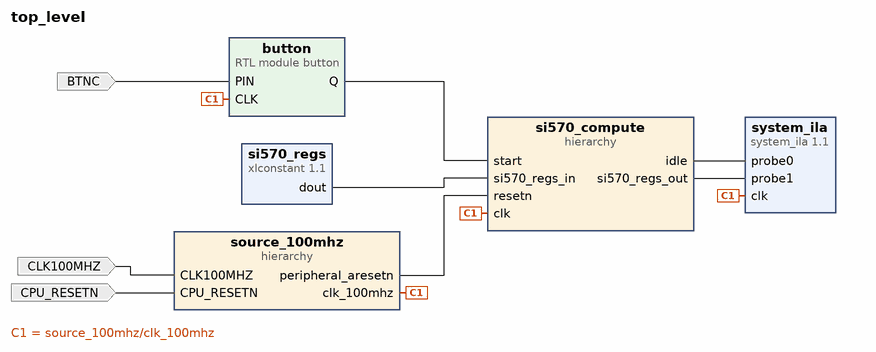
[diagram p0: block diagram of the top level]
# Vivado block design top_level, xc7a100tcsg324-1, Vivado 2021.1
create_bd_design top_level

create_bd_port -dir I -type clk CLK100MHZ
set_property -dict {CONFIG.ASSOCIATED_RESET CPU_RESETN} [get_bd_ports CLK100MHZ]
create_bd_port -dir I -type rst CPU_RESETN
create_bd_port -dir I BTNC

create_bd_cell -type hier source_100mhz
create_bd_cell -type module -reference button button
create_bd_cell -type ip -vlnv xilinx.com:ip:xlconstant:1.1 si570_regs
set_property -dict {CONFIG.CONST_VAL 0x01C2BC011EB8 CONFIG.CONST_WIDTH 48} [get_bd_cells si570_regs]
create_bd_cell -type hier si570_compute
create_bd_cell -type ip -vlnv xilinx.com:ip:system_ila:1.1 system_ila
set_property -dict {CONFIG.C_MON_TYPE NATIVE CONFIG.C_NUM_OF_PROBES 2} [get_bd_cells system_ila]

# ---- hierarchy /source_100mhz ----
current_bd_instance /source_100mhz
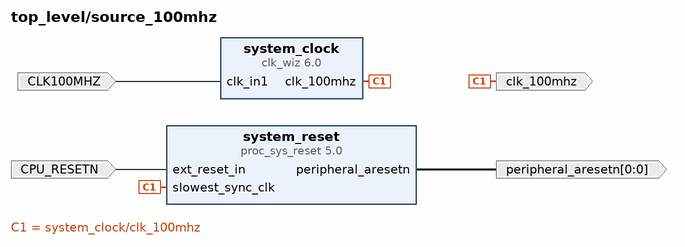
[diagram p1: block diagram inside /source_100mhz]
create_bd_pin -dir I -type clk CLK100MHZ
create_bd_pin -dir O -type clk clk_100mhz
create_bd_pin -dir I -type rst CPU_RESETN
create_bd_pin -dir O -from 0 -to 0 -type rst peripheral_aresetn

create_bd_cell -type ip -vlnv xilinx.com:ip:clk_wiz:6.0 system_clock
set_property -dict [list \
  CONFIG.CLKOUT1_DRIVES BUFGCE \
  CONFIG.CLKOUT2_DRIVES BUFGCE \
  CONFIG.CLKOUT3_DRIVES BUFGCE \
  CONFIG.CLKOUT4_DRIVES BUFGCE \
  CONFIG.CLKOUT5_DRIVES BUFGCE \
  CONFIG.CLKOUT6_DRIVES BUFGCE \
  CONFIG.CLKOUT7_DRIVES BUFGCE \
  CONFIG.CLK_OUT1_PORT clk_100mhz \
  CONFIG.FEEDBACK_SOURCE FDBK_AUTO \
  CONFIG.USE_LOCKED false \
  CONFIG.USE_RESET false \
  CONFIG.USE_SAFE_CLOCK_STARTUP true \
] [get_bd_cells system_clock]
create_bd_cell -type ip -vlnv xilinx.com:ip:proc_sys_reset:5.0 system_reset

# ---- hierarchy /si570_compute ----
current_bd_instance /si570_compute
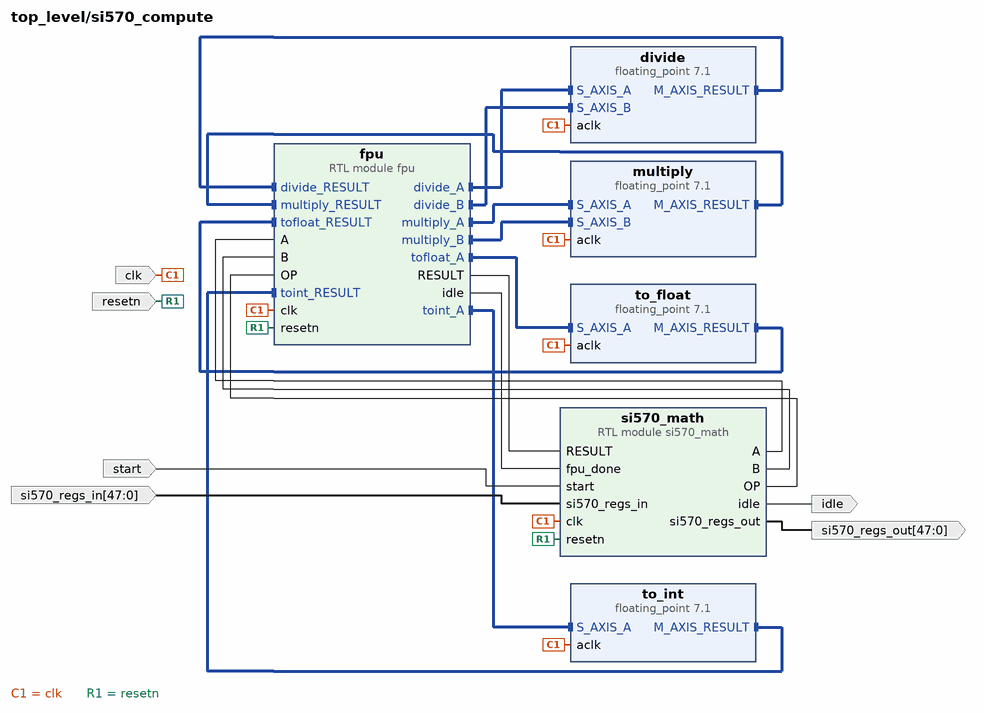
[diagram p2: block diagram inside /si570_compute]
create_bd_pin -dir I -type clk clk
create_bd_pin -dir I -type rst resetn
create_bd_pin -dir I start
create_bd_pin -dir I -from 47 -to 0 si570_regs_in
create_bd_pin -dir O idle
create_bd_pin -dir O -from 47 -to 0 si570_regs_out

create_bd_cell -type ip -vlnv xilinx.com:ip:floating_point:7.1 to_int
set_property -dict [list \
  CONFIG.A_Precision_Type Double \
  CONFIG.C_Accum_Input_Msb 32 \
  CONFIG.C_Accum_Lsb -31 \
  CONFIG.C_Accum_Msb 32 \
  CONFIG.C_Latency 7 \
  CONFIG.C_Mult_Usage No_Usage \
  CONFIG.C_Rate 1 \
  CONFIG.C_Result_Exponent_Width 64 \
  CONFIG.C_Result_Fraction_Width 0 \
  CONFIG.Operation_Type Float_to_fixed \
  CONFIG.Result_Precision_Type Custom \
] [get_bd_cells to_int]
create_bd_cell -type ip -vlnv xilinx.com:ip:floating_point:7.1 to_float
set_property -dict [list \
  CONFIG.A_Precision_Type Uint64 \
  CONFIG.C_A_Exponent_Width 64 \
  CONFIG.C_A_Fraction_Width 0 \
  CONFIG.C_Accum_Input_Msb 32 \
  CONFIG.C_Accum_Lsb -31 \
  CONFIG.C_Accum_Msb 32 \
  CONFIG.C_Latency 7 \
  CONFIG.C_Mult_Usage No_Usage \
  CONFIG.C_Rate 1 \
  CONFIG.C_Result_Exponent_Width 11 \
  CONFIG.C_Result_Fraction_Width 53 \
  CONFIG.Operation_Type Fixed_to_float \
  CONFIG.Result_Precision_Type Double \
] [get_bd_cells to_float]
create_bd_cell -type ip -vlnv xilinx.com:ip:floating_point:7.1 multiply
set_property -dict [list \
  CONFIG.A_Precision_Type Double \
  CONFIG.C_Accum_Input_Msb 32 \
  CONFIG.C_Accum_Lsb -31 \
  CONFIG.C_Accum_Msb 32 \
  CONFIG.C_Latency 16 \
  CONFIG.C_Mult_Usage Full_Usage \
  CONFIG.C_Rate 1 \
  CONFIG.C_Result_Exponent_Width 11 \
  CONFIG.C_Result_Fraction_Width 53 \
  CONFIG.Operation_Type Multiply \
  CONFIG.Result_Precision_Type Double \
] [get_bd_cells multiply]
create_bd_cell -type ip -vlnv xilinx.com:ip:floating_point:7.1 divide
set_property -dict [list \
  CONFIG.A_Precision_Type Double \
  CONFIG.C_Accum_Input_Msb 32 \
  CONFIG.C_Accum_Lsb -31 \
  CONFIG.C_Accum_Msb 32 \
  CONFIG.C_Latency 58 \
  CONFIG.C_Mult_Usage No_Usage \
  CONFIG.C_Rate 1 \
  CONFIG.C_Result_Exponent_Width 11 \
  CONFIG.C_Result_Fraction_Width 53 \
  CONFIG.Operation_Type Divide \
  CONFIG.Result_Precision_Type Double \
] [get_bd_cells divide]
create_bd_cell -type module -reference si570_math si570_math
create_bd_cell -type module -reference fpu fpu

# ---- connections ----

current_bd_instance /source_100mhz
connect_bd_net [get_bd_pins CLK100MHZ] [get_bd_pins system_clock/clk_in1]
connect_bd_net [get_bd_pins CPU_RESETN] [get_bd_pins system_reset/ext_reset_in]
connect_bd_net [get_bd_pins system_clock/clk_100mhz] [get_bd_pins clk_100mhz] [get_bd_pins system_reset/slowest_sync_clk]
connect_bd_net [get_bd_pins system_reset/peripheral_aresetn] [get_bd_pins peripheral_aresetn]

current_bd_instance /si570_compute
connect_bd_intf_net -intf_net fp_divide_M_AXIS_RESULT [get_bd_intf_pins divide/M_AXIS_RESULT] [get_bd_intf_pins fpu/divide_RESULT]
connect_bd_intf_net -intf_net fp_multiply_M_AXIS_RESULT [get_bd_intf_pins multiply/M_AXIS_RESULT] [get_bd_intf_pins fpu/multiply_RESULT]
connect_bd_intf_net [get_bd_intf_pins to_float/M_AXIS_RESULT] [get_bd_intf_pins fpu/tofloat_RESULT]
connect_bd_intf_net [get_bd_intf_pins divide/S_AXIS_A] [get_bd_intf_pins fpu/divide_A]
connect_bd_intf_net [get_bd_intf_pins divide/S_AXIS_B] [get_bd_intf_pins fpu/divide_B]
connect_bd_intf_net [get_bd_intf_pins multiply/S_AXIS_A] [get_bd_intf_pins fpu/multiply_A]
connect_bd_intf_net [get_bd_intf_pins multiply/S_AXIS_B] [get_bd_intf_pins fpu/multiply_B]
connect_bd_intf_net [get_bd_intf_pins to_float/S_AXIS_A] [get_bd_intf_pins fpu/tofloat_A]
connect_bd_intf_net [get_bd_intf_pins fpu/toint_A] [get_bd_intf_pins to_int/S_AXIS_A]
connect_bd_intf_net [get_bd_intf_pins to_int/M_AXIS_RESULT] [get_bd_intf_pins fpu/toint_RESULT]
connect_bd_net -net button_0_Q [get_bd_pins start] [get_bd_pins si570_math/start]
connect_bd_net [get_bd_pins fpu/RESULT] [get_bd_pins si570_math/RESULT]
connect_bd_net -net fpu_done [get_bd_pins fpu/idle] [get_bd_pins si570_math/fpu_done]
connect_bd_net -net si570_math_0_A [get_bd_pins si570_math/A] [get_bd_pins fpu/A]
connect_bd_net -net si570_math_0_B [get_bd_pins si570_math/B] [get_bd_pins fpu/B]
connect_bd_net -net si570_math_0_OP [get_bd_pins si570_math/OP] [get_bd_pins fpu/OP]
connect_bd_net -net si570_math_done [get_bd_pins si570_math/idle] [get_bd_pins idle]
connect_bd_net [get_bd_pins si570_math/si570_regs_out] [get_bd_pins si570_regs_out]
connect_bd_net -net si570_regs_dout [get_bd_pins si570_regs_in] [get_bd_pins si570_math/si570_regs_in]
connect_bd_net -net source_100mhz_clk_100mhz [get_bd_pins clk] \
  [get_bd_pins to_int/aclk] [get_bd_pins to_float/aclk] [get_bd_pins multiply/aclk] [get_bd_pins divide/aclk] \
  [get_bd_pins si570_math/clk] [get_bd_pins fpu/clk]
connect_bd_net -net source_100mhz_peripheral_aresetn [get_bd_pins resetn] [get_bd_pins si570_math/resetn] [get_bd_pins fpu/resetn]

current_bd_instance /
connect_bd_net [get_bd_ports CLK100MHZ] [get_bd_pins source_100mhz/CLK100MHZ]
connect_bd_net [get_bd_ports CPU_RESETN] [get_bd_pins source_100mhz/CPU_RESETN]
connect_bd_net -net PIN_0_1 [get_bd_ports BTNC] [get_bd_pins button/PIN]
connect_bd_net -net button_0_Q [get_bd_pins button/Q] [get_bd_pins si570_compute/start]
connect_bd_net [get_bd_pins si570_compute/idle] [get_bd_pins system_ila/probe0]
connect_bd_net [get_bd_pins si570_compute/si570_regs_out] [get_bd_pins system_ila/probe1]
connect_bd_net [get_bd_pins si570_regs/dout] [get_bd_pins si570_compute/si570_regs_in]
connect_bd_net [get_bd_pins source_100mhz/clk_100mhz] [get_bd_pins button/CLK] [get_bd_pins si570_compute/clk] [get_bd_pins system_ila/clk]
connect_bd_net [get_bd_pins source_100mhz/peripheral_aresetn] [get_bd_pins si570_compute/resetn]

validate_bd_design
save_bd_design
